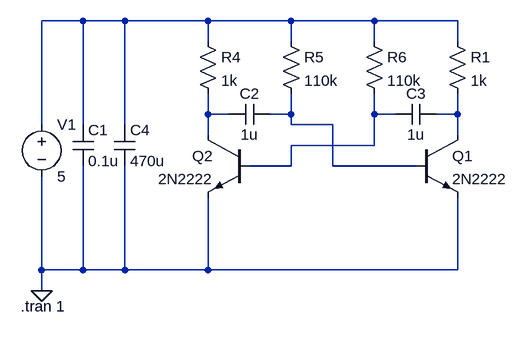
[diagram p0: schematic Multivibrator.asc]
Multivibrator.asc, the LTspice schematic file:
Version 4
SHEET 1 1784 680
WIRE 224 32 160 32
WIRE 288 32 224 32
WIRE 416 32 288 32
WIRE 544 32 416 32
WIRE 672 32 544 32
WIRE 800 32 672 32
WIRE 416 64 416 32
WIRE 544 64 544 32
WIRE 672 64 672 32
WIRE 800 64 800 32
WIRE 416 176 416 144
WIRE 448 176 416 176
WIRE 544 176 544 144
WIRE 544 176 512 176
WIRE 672 176 672 144
WIRE 704 176 672 176
WIRE 800 176 800 144
WIRE 800 176 768 176
WIRE 160 192 160 32
WIRE 224 192 224 32
WIRE 288 192 288 32
WIRE 544 192 544 176
WIRE 608 192 544 192
WIRE 416 208 416 176
WIRE 800 208 800 176
WIRE 672 224 672 176
WIRE 672 224 544 224
WIRE 544 256 544 224
WIRE 544 256 480 256
WIRE 608 256 608 192
WIRE 736 256 608 256
WIRE 160 416 160 272
WIRE 224 416 224 256
WIRE 224 416 160 416
WIRE 288 416 288 256
WIRE 288 416 224 416
WIRE 416 416 416 304
WIRE 416 416 288 416
WIRE 800 416 800 304
WIRE 800 416 416 416
WIRE 160 448 160 416
FLAG 160 448 0
SYMBOL voltage 160 176 R0
WINDOW 123 0 0 Left 0
WINDOW 39 0 0 Left 0
SYMATTR InstName V1
SYMATTR Value 5
SYMBOL res 400 48 R0
SYMATTR InstName R4
SYMATTR Value 1k
SYMBOL res 528 48 R0
SYMATTR InstName R5
SYMATTR Value 110k
SYMBOL res 656 48 R0
SYMATTR InstName R6
SYMATTR Value 110k
SYMBOL cap 208 192 R0
SYMATTR InstName C1
SYMATTR Value 0.1u
SYMBOL cap 512 160 R90
WINDOW 0 0 32 VBottom 2
WINDOW 3 32 32 VTop 2
SYMATTR InstName C2
SYMATTR Value 1u
SYMBOL cap 768 160 R90
WINDOW 0 0 32 VBottom 2
WINDOW 3 32 32 VTop 2
SYMATTR InstName C3
SYMATTR Value 1u
SYMBOL npn 736 208 R0
SYMATTR InstName Q1
SYMATTR Value 2N2222
SYMBOL npn 480 208 M0
SYMATTR InstName Q2
SYMATTR Value 2N2222
SYMBOL res 784 48 R0
SYMATTR InstName R1
SYMATTR Value 1k
SYMBOL cap 272 192 R0
SYMATTR InstName C4
SYMATTR Value 470u
TEXT 128 472 Left 2 !.tran 1

The netlist it stands for:
* Multivibrator.asc
V1 N001 0 5
R4 N001 N002 1k
R5 N001 N003 110k
R6 N001 N004 110k
C1 N001 0 0.1u
C2 N003 N002 1u
C3 N005 N004 1u
Q1 N005 N003 0 0 2N2222
Q2 N002 N004 0 0 2N2222
R1 N001 N005 1k
C4 N001 0 470u
.model NPN NPN
.model PNP PNP
.lib standard.bjt
.tran 1
.backanno
.end